# EAGLE schematic STorM32 BGC v1202 (EAGLE 6.5.0)
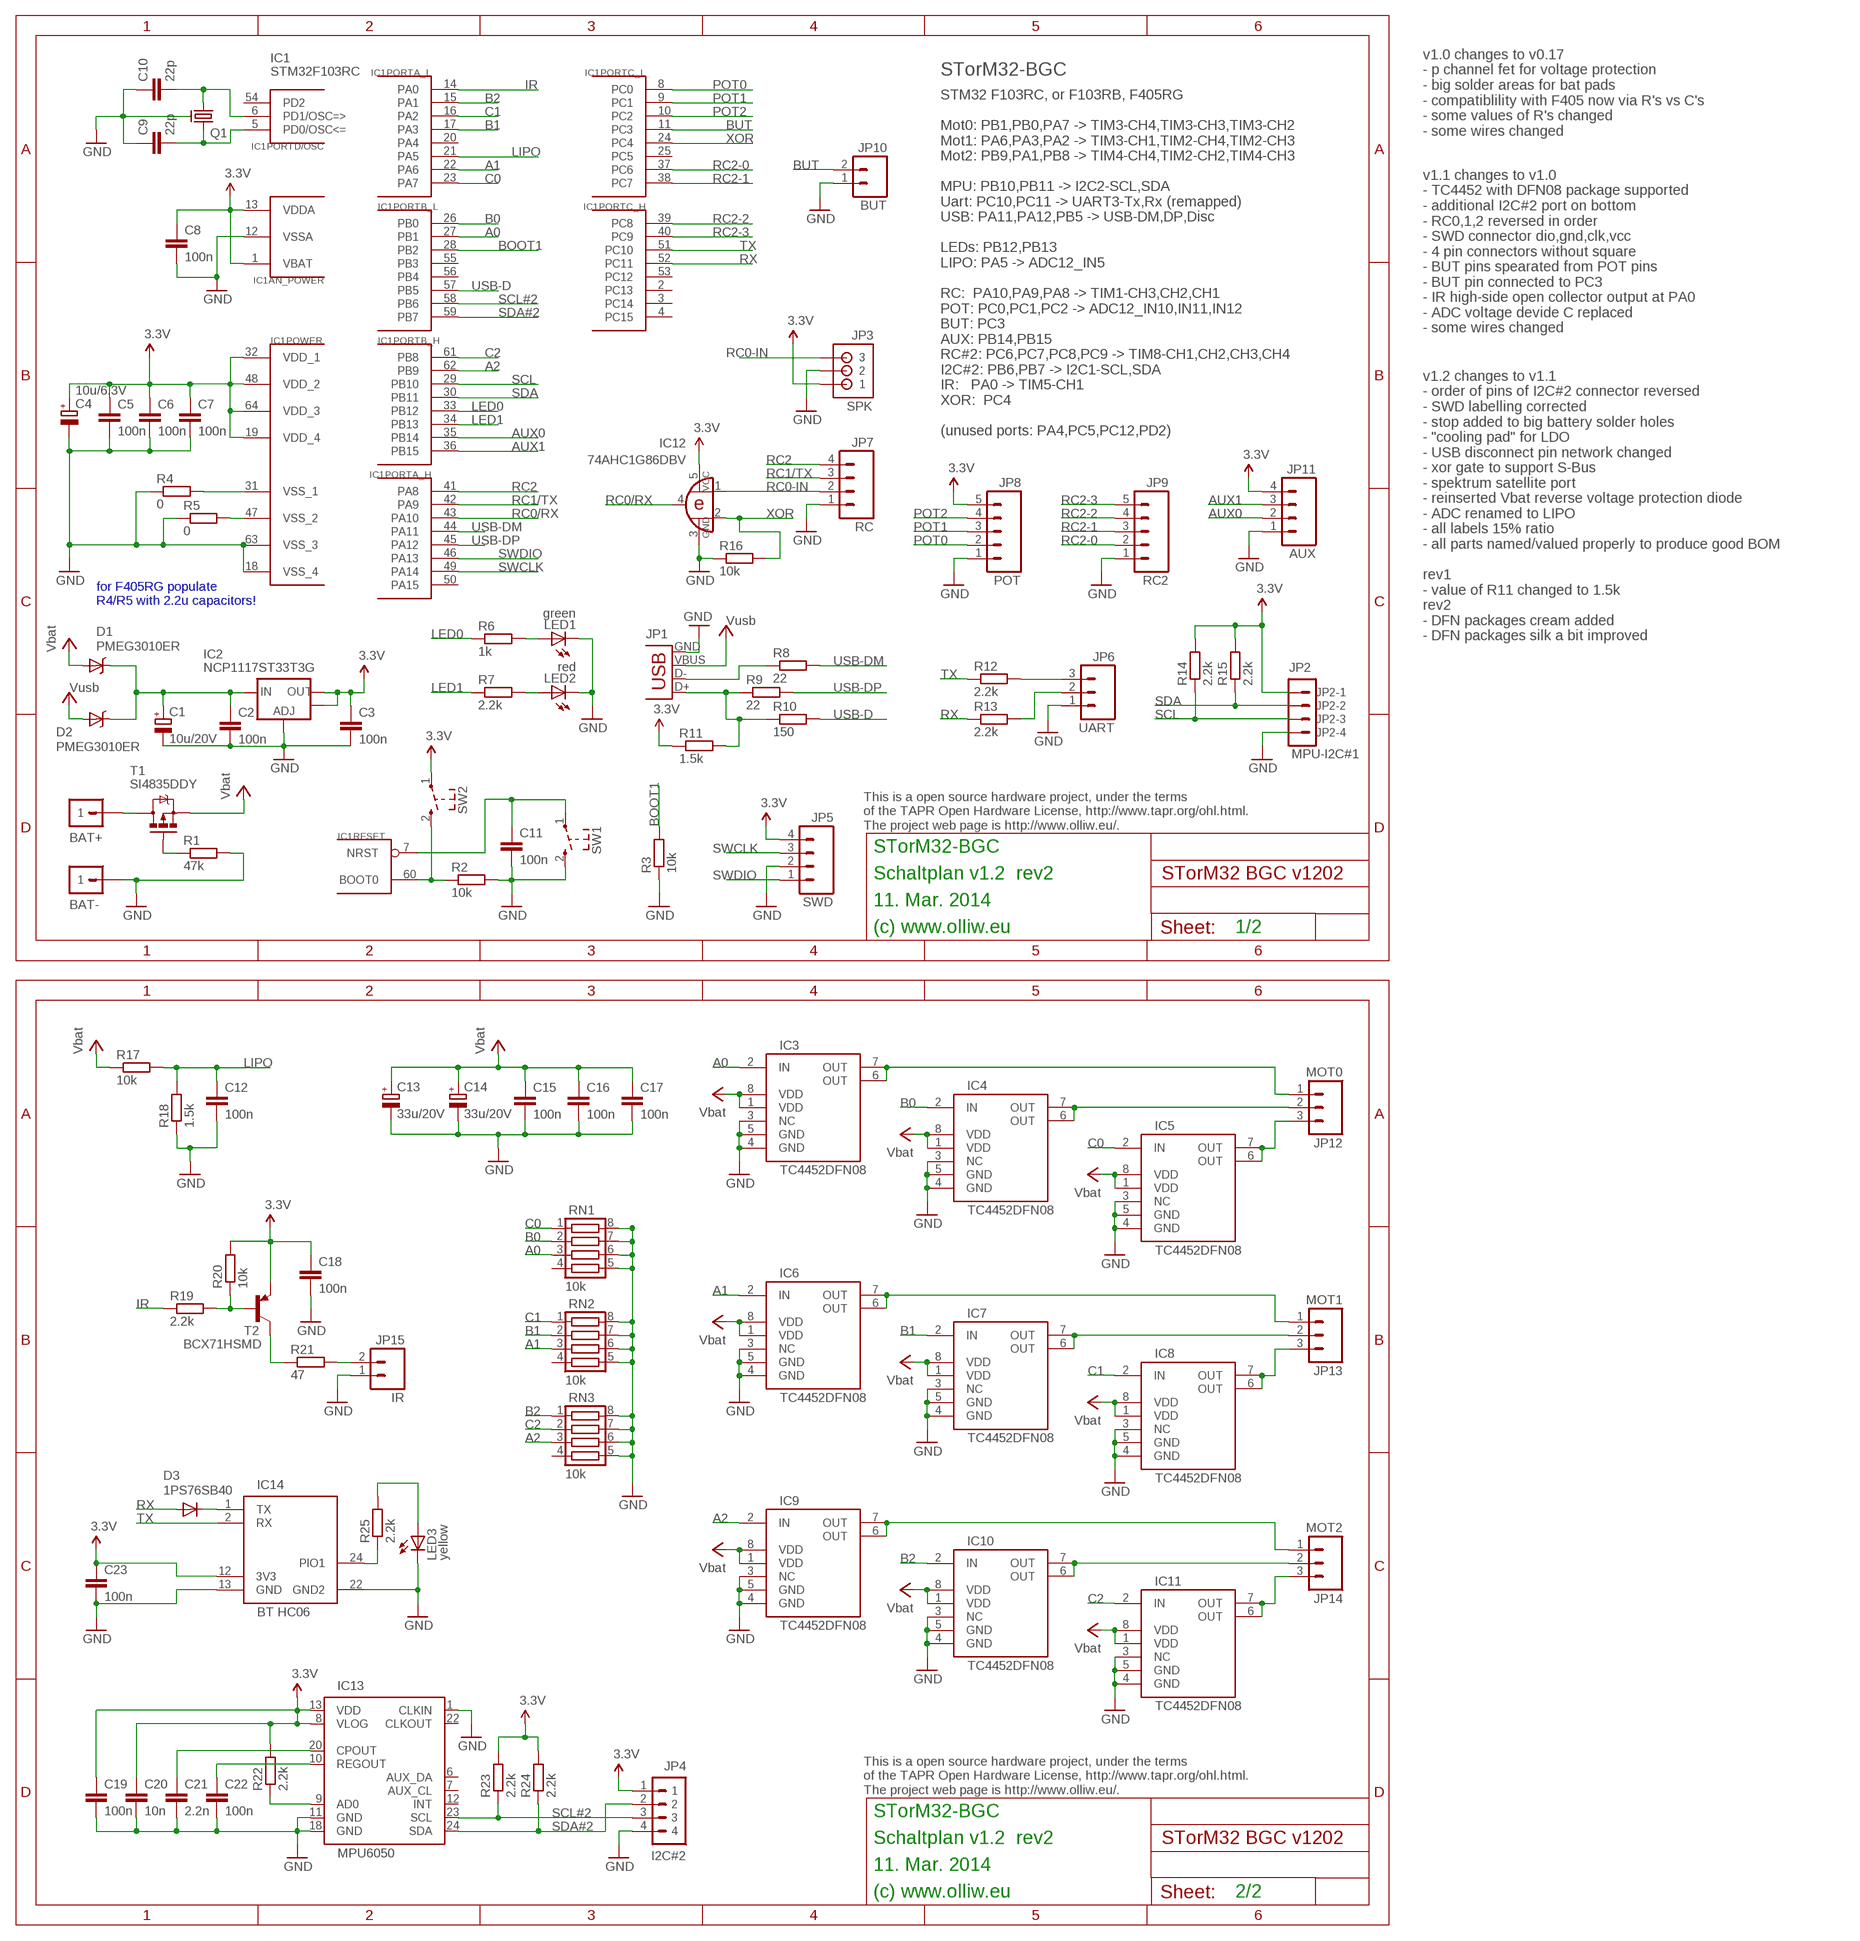
[diagram p0: schematic, sheet 1]

## Parts
BAT+  M1X1  [1X1_WITHOUT]
BAT-  M1X1  [1X1_WITHOUT]
C1  10u/20V  CPOL-EUSMCB  [SMC_B]
C2  100n  C-EUC0603  [C0603]
C3  100n  C-EUC0603  [C0603]
C4  10u/6.3V  CPOL-EUSMCA  [SMC_A]
C5  100n  C-EUC0603  [C0603]
C6  100n  C-EUC0603  [C0603]
C7  100n  C-EUC0603  [C0603]
C8  100n  C-EUC0603  [C0603]
C9  22p  C-EUC0603  [C0603]
C10  22p  C-EUC0603  [C0603]
C11  100n  C-EUC0603  [C0603]
C12  100n  C-EUC0603  [C0603]
C13  33u/20V  CPOL-EUSMCC  [SMC_C]
C14  33u/20V  CPOL-EUSMCC  [SMC_C]
C15  100n  C-EUC0603  [C0603]
C16  100n  C-EUC0603  [C0603]
C17  100n  C-EUC0603  [C0603]
C18  100n  C-EUC0603  [C0603]
C19  100n  C-EUC0603  [C0603]
C20  10n  C-EUC0603  [C0603]
C21  2.2n  C-EUC0603  [C0603]
C22  100n  C-EUC0603  [C0603]
C23  100n  C-EUC0603  [C0603]
D1  PMEG3010ER  DIODE-SCHOTTKYSOD123-W  [SOD123W-DIODE]
D2  PMEG3010ER  DIODE-SCHOTTKYSOD123-W  [SOD123W-DIODE]
D3  1PS76SB40  DIODE-SOD110-R  [SOD110-R]
IC1  STM32F103RCT6  STM32F10XRXT6  [TQFP64]
IC2  NCP1117ST33T3G  V_REG_LM1117SOT223  [SOT223]
IC3  TC4452DFN08  [DFN8]
IC4  TC4452DFN08  [DFN8]
IC5  TC4452DFN08  [DFN8]
IC6  TC4452DFN08  [DFN8]
IC7  TC4452DFN08  [DFN8]
IC8  TC4452DFN08  [DFN8]
IC9  TC4452DFN08  [DFN8]
IC10  TC4452DFN08  [DFN8]
IC11  TC4452DFN08  [DFN8]
IC12  74AHC1G86DBV  [SOT23-5]
IC13  MPU6050  IMU3000  [QFN-24]
IC14  BT HC06  HC06-BASIC  [BT_HC05_BASIC]
JP1  USBMINIBSMD  USBSMD  [USB-MINIB]
JP2  MPU-I2C#1  53-04  [53047-04SMALL]
JP3  SPK  B3B-ZR  [B3B-ZR]
JP4  I2C#2  P4X1_1P27  [MOLEX-53261-04-SMD-FLAT]
JP5  SWD  M04PTH  [1X04]
JP6  UART  M03PTH  [1X03]
JP7  RC  M04PTH  [1X04]
JP8  POT  M05PTH  [1X05]
JP9  RC2  M05PTH  [1X05]
JP10  BUT  M02PTH  [1X02]
JP11  AUX  M04PTH  [1X04]
JP12  MOT0  M03PTH  [1X03]
JP13  MOT1  M03PTH  [1X03]
JP14  MOT2  M03PTH  [1X03]
JP15  IR  M02PTH  [1X02]
LED1  green  LEDCHIPLED_0603  [CHIPLED_0603]
LED2  red  LEDCHIPLED_0603  [CHIPLED_0603]
LED3  yellow  LEDCHIPLED_0603  [CHIPLED_0603]
Q1  7B-8.000MAAJ-T  CRYSTALSMD-5X3  [CRYTSAL-SMD-5X3]
R1  47k  R-EU_R0603  [R0603]
R2  10k  R-EU_R0603  [R0603]
R3  10k  R-EU_R0603  [R0603]
R4  0  R-EU_R0603  [R0603]
R5  0  R-EU_R0603  [R0603]
R6  1k  R-EU_R0603  [R0603]
R7  2.2k  R-EU_R0603  [R0603]
R8  22  R-EU_R0603  [R0603]
R9  22  R-EU_R0603  [R0603]
R10  150  R-EU_R0603  [R0603]
R11  1.5k  R-EU_R0603  [R0603]
R12  2.2k  R-EU_R0603  [R0603]
R13  2.2k  R-EU_R0603  [R0603]
R14  2.2k  R-EU_R0603  [R0603]
R15  2.2k  R-EU_R0603  [R0603]
R16  10k  R-EU_R0603  [R0603]
R17  10k  R-EU_R0603  [R0603]
R18  1.5k  R-EU_R0603  [R0603]
R19  2.2k  R-EU_R0603  [R0603]
R20  10k  R-EU_R0603  [R0603]
R21  47  R-EU_R0603  [R0603]
R22  2.2k  R-EU_R0603  [R0603]
R23  2.2k  R-EU_R0603  [R0603]
R24  2.2k  R-EU_R0603  [R0603]
R25  2.2k  R-EU_R0603  [R0603]
RN1  10k  CTS742C083  [CTS742C083]
RN2  10k  CTS742C083  [CTS742C083]
RN3  10k  CTS742C083  [CTS742C083]
SW1  SW_TACT_2P-3X6  [SW_TACT_3X6]
SW2  SW_TACT_2P-3X6  [SW_TACT_3X6]
T1  SI4835DDY  FET-PS008  [SO08]
T2  BCX71HSMD  BCX71SMD  [SOT23]

## Nets
3.3V: C3.1 C4.+ C5.1 C6.1 C7.1 C8.1 C18.1 C19.1 C20.1 C23.1 IC1.1(AN_POWER:VBAT) IC1.13(AN_POWER:VDDA) IC1.19(POWER:VDD_4) IC1.32(POWER:VDD_1) IC1.48(POWER:VDD_2) IC1.64(POWER:VDD_3) IC2.2(OUT) IC2.4(OUT) IC12.5(VCC) IC13.8(VLOG) IC13.13(VDD) IC14.12(3V3) JP2.1 JP3.1 JP4.1 JP5.4 JP8.5 JP11.4 R11.1 R14.2 R15.2 R20.2 R22.2 R23.2 R24.2 SW2.1 T2.2(E)
A0: IC1.27(PORTB_L:PB1) IC3.2(IN) RN1.3
A1: IC1.22(PORTA_L:PA6) IC6.2(IN) RN2.3
A2: IC1.62(PORTB_H:PB9) IC9.2(IN) RN3.3
AUX0: IC1.35(PORTB_H:PB14) JP11.2
AUX1: IC1.36(PORTB_H:PB15) JP11.3
B0: IC1.26(PORTB_L:PB0) IC4.2(IN) RN1.2
B1: IC1.17(PORTA_L:PA3) IC7.2(IN) RN2.2
B2: IC1.15(PORTA_L:PA1) IC10.2(IN) RN3.1
BATP: BAT+.1 T1.5(D) T1.6(D) T1.7(D) T1.8(D)
BOOT1: IC1.28(PORTB_L:PB2) R3.2
BUT: IC1.11(PORTC_L:PC3) JP10.2
C0: IC1.23(PORTA_L:PA7) IC5.2(IN) RN1.1
C1: IC1.16(PORTA_L:PA2) IC8.2(IN) RN2.1
C2: IC1.61(PORTB_H:PB8) IC11.2(IN) RN3.2
GND: BAT-.1 C1.- C2.2 C3.2 C4.- C5.2 C6.2 C7.2 C8.2 C9.1 C10.1 C11.2 C12.2 C13.- C14.- C15.2 C16.2 C17.2 C18.2 C19.2 C20.2 C21.2 C22.2 C23.2 IC1.12(AN_POWER:VSSA) IC1.18(POWER:VSS_4) IC1.63(POWER:VSS_3) IC2.1(ADJ) IC3.3(NC) IC3.4(GND) IC3.5(GND) IC4.3(NC) IC4.4(GND) IC4.5(GND) IC5.3(NC) IC5.4(GND) IC5.5(GND) IC6.3(NC) IC6.4(GND) IC6.5(GND) IC7.3(NC) IC7.4(GND) IC7.5(GND) IC8.3(NC) IC8.4(GND) IC8.5(GND) IC9.3(NC) IC9.4(GND) IC9.5(GND) IC10.3(NC) IC10.4(GND) IC10.5(GND) IC11.3(NC) IC11.4(GND) IC11.5(GND) IC12.3(GND) IC13.1(CLKIN) IC13.11(GND) IC13.18(GND) IC14.13(GND) IC14.22(GND2) JP1.GND JP2.4 JP3.2 JP4.4 JP5.2 JP6.1 JP7.1 JP8.1 JP9.1 JP10.1 JP11.1 JP15.1 LED1.C LED2.C LED3.C Q1.2 Q1.4 R1.2 R2.2 R3.1 R4.1 R5.1 R16.1 R18.1 RN1.5 RN1.6 RN1.7 RN1.8 RN2.5 RN2.6 RN2.7 RN2.8 RN3.5 RN3.6 RN3.7 RN3.8 SW1.2
IR: IC1.14(PORTA_L:PA0) R19.1
LED0: IC1.33(PORTB_H:PB12) R6.1
LED1: IC1.34(PORTB_H:PB13) R7.1
LIPO: C12.1 IC1.21(PORTA_L:PA5) R17.2 R18.2
M0A: IC3.6(OUT) IC3.7(OUT) JP12.1
M0B: IC4.6(OUT) IC4.7(OUT) JP12.2
M0C: IC5.6(OUT) IC5.7(OUT) JP12.3
M1A: IC6.6(OUT) IC6.7(OUT) JP13.1
M1B: IC7.6(OUT) IC7.7(OUT) JP13.2
M1C: IC8.6(OUT) IC8.7(OUT) JP13.3
M2A: IC9.6(OUT) IC9.7(OUT) JP14.1
M2B: IC10.6(OUT) IC10.7(OUT) JP14.2
M2C: IC11.6(OUT) IC11.7(OUT) JP14.3
N$1: R21.1 T2.3(C)
N$2: JP15.2 R21.2
N$5: C11.1 IC1.7(RESET:NRST) SW1.1
N$6: IC1.60(RESET:BOOT0) R2.1 SW2.2
N$8: LED1.A R6.2
N$9: LED2.A R7.2
N$10: IC1.47(POWER:VSS_2) R5.2
N$11: C9.2 IC1.5(PORTD/OSC:PD0/OSC<=) Q1.3
N$12: C10.2 IC1.6(PORTD/OSC:PD1/OSC=>) Q1.1
N$15: JP1.D- R8.1
N$17: JP1.D+ R9.1 R10.1 R11.2
N$19: IC13.9(AD0) R22.1
N$20: C22.1 IC13.10(REGOUT)
N$21: IC14.24(PIO1) R25.1
N$22: LED3.A R25.2
N$23: R1.1 T1.4(G)
N$24: C21.1 IC13.20(CPOUT)
N$25: D3.C IC14.1(TX)
N$26: IC1.31(POWER:VSS_1) R4.2
N$27: R19.2 R20.1 T2.1(B)
N$29: JP6.2 R13.2
N$32: JP6.3 R12.2
POT0: IC1.8(PORTC_L:PC0) JP8.2
POT1: IC1.9(PORTC_L:PC1) JP8.3
POT2: IC1.10(PORTC_L:PC2) JP8.4
RC0-IN: IC12.1(I0) JP3.3 JP7.2
RC0/RX: IC1.43(PORTA_H:PA10) IC12.4(O)
RC1/TX: IC1.42(PORTA_H:PA9) JP7.3
RC2: IC1.41(PORTA_H:PA8) JP7.4
RC2-0: IC1.37(PORTC_L:PC6) JP9.2
RC2-1: IC1.38(PORTC_L:PC7) JP9.3
RC2-2: IC1.39(PORTC_H:PC8) JP9.4
RC2-3: IC1.40(PORTC_H:PC9) JP9.5
RX: D3.A IC1.52(PORTC_H:PC11) R13.1
SCL: IC1.29(PORTB_H:PB10) JP2.3 R14.1
SCL#2: IC1.58(PORTB_L:PB6) IC13.23(SCL) JP4.3 R23.1
SDA: IC1.30(PORTB_H:PB11) JP2.2 R15.1
SDA#2: IC1.59(PORTB_L:PB7) IC13.24(SDA) JP4.2 R24.1
SWCLK: IC1.49(PORTA_H:PA14) JP5.3
SWDIO: IC1.46(PORTA_H:PA13) JP5.1
TX: IC1.51(PORTC_H:PC10) IC14.2(RX) R12.1
USB-D: IC1.57(PORTB_L:PB5) R10.2
USB-DM: IC1.44(PORTA_H:PA11) R8.2
USB-DP: IC1.45(PORTA_H:PA12) R9.2
VCC: C13.+ C14.+ C15.1 C16.1 C17.1 D1.A IC3.1(VDD) IC3.8(VDD) IC4.1(VDD) IC4.8(VDD) IC5.1(VDD) IC5.8(VDD) IC6.1(VDD) IC6.8(VDD) IC7.1(VDD) IC7.8(VDD) IC8.1(VDD) IC8.8(VDD) IC9.1(VDD) IC9.8(VDD) IC10.1(VDD) IC10.8(VDD) IC11.1(VDD) IC11.8(VDD) R17.1 T1.1(S) T1.2(S) T1.3(S) ; supply symbol labelled Vbat
VIN: C1.+ C2.1 D1.C D2.C IC2.3(IN)
VUSB: D2.A JP1.VBUS ; supply symbol labelled Vusb
XOR: IC1.24(PORTC_L:PC4) IC12.2(I1) R16.2
Unconnected: IC1.2(PORTC_H:PC13) IC1.3(PORTC_H:PC14) IC1.4(PORTC_H:PC15) IC1.20(PORTA_L:PA4) IC1.25(PORTC_L:PC5) IC1.50(PORTA_H:PA15) IC1.53(PORTC_H:PC12) IC1.54(PORTD/OSC:PD2) IC1.55(PORTB_L:PB3) IC1.56(PORTB_L:PB4) IC13.6(AUX_DA) IC13.7(AUX_CL) IC13.12(INT) IC13.22(CLKOUT) RN1.4 RN2.4 RN3.4

## Notes on the sheet
- v1.0 changes to v0.17
  - p channel fet for voltage protection
  - big solder areas for bat pads
  - compatiblility with F405 now via R's vs C's
  - some values of R's changed
  - some wires changed
- IC1
- STM32F103RC | STorM32-BGC
- STM32 F103RC, or F103RB, F405RG
  
  Mot0: PB1,PB0,PA7 -> TIM3-CH4,TIM3-CH3,TIM3-CH2
  Mot1: PA6,PA3,PA2 -> TIM3-CH1,TIM2-CH4,TIM2-CH3
  Mot2: PB9,PA1,PB8 -> TIM4-CH4,TIM2-CH2,TIM4-CH3
  
  MPU: PB10,PB11 -> I2C2-SCL,SDA
  Uart: PC10,PC11 -> UART3-Tx,Rx (remapped)
  USB: PA11,PA12,PB5 -> USB-DM,DP,Disc
  
  LEDs: PB12,PB13
  LIPO: PA5 -> ADC12_IN5
  
  RC:  PA10,PA9,PA8 -> TIM1-CH3,CH2,CH1
  POT: PC0,PC1,PC2 -> ADC12_IN10,IN11,IN12
  BUT: PC3
  AUX: PB14,PB15
  RC#2: PC6,PC7,PC8,PC9 -> TIM8-CH1,CH2,CH3,CH4
  I2C#2: PB6,PB7 -> I2C1-SCL,SDA
  IR:   PA0 -> TIM5-CH1
  XOR:  PC4
  
  (unused ports: PA4,PC5,PC12,PD2)
- v1.1 changes to v1.0
  - TC4452 with DFN08 package supported
  - additional I2C#2 port on bottom
  - RC0,1,2 reversed in order
  - SWD connector dio,gnd,clk,vcc
  - 4 pin connectors without square
  - BUT pins spearated from POT pins
  - BUT pin connected to PC3
  - IR high-side open collector output at PA0
  - ADC voltage devide C replaced
  - some wires changed
- v1.2 changes to v1.1
  - order of pins of I2C#2 connector reversed
  - SWD labelling corrected
  - stop added to big battery solder holes
  - "cooling pad" for LDO
  - USB disconnect pin network changed
  - xor gate to support S-Bus
  - spektrum satellite port
  - reinserted Vbat reverse voltage protection diode
  - ADC renamed to LIPO
  - all labels 15% ratio
  - all parts named/valued properly to produce good BOM
  
  rev1
  - value of R11 changed to 1.5k
  rev2
  - DFN packages cream added
  - DFN packages silk a bit improved
- for F405RG populate
  R4/R5 with 2.2u capacitors!
- JP1
- JP2
- This is a open source hardware project, under the terms
  of the TAPR Open Hardware License, http://www.tapr.org/ohl.html.
  The project web page is http://www.olliw.eu/.
- STorM32-BGC
- Schaltplan v1.2  rev2
- 11. Mar. 2014
- (c) www.olliw.eu | 1/2
- This is a open source hardware project, under the terms
  of the TAPR Open Hardware License, http://www.tapr.org/ohl.html.
  The project web page is http://www.olliw.eu/.
- STorM32-BGC
- Schaltplan v1.2  rev2
- 11. Mar. 2014
- (c) www.olliw.eu | 2/2

## Library data of the parts
BAT+ BAT- = # stdlib:M1X1
C1 C4 C13 C14 = rcl:CPOL-EU: POLARIZED CAPACITOR, European symbol
C2 C3 C5-C12 C15-C23 = rcl:C-EU: CAPACITOR, European symbol
D1 D2 = # stdlib:DIODE-SCHOTTKY
D3 = diode:DIODE-: DIODE
IC1 = # stm32:STM32F10XRXT6: STM32F101/103 64pin LQFP
IC2 = # SparkFun2:V_REG_LM1117: Voltage Regulator LM1117 Standard adjustable voltage regulator but in SMD form. Spark Fun Electronics SKU : COM-00595
IC3-IC11 = # stdlib:TC4452
IC12 = 74xx-little-de:74*1G86: 2-input EXCLUSIV-OR gate
IC13 = # SparkFun2:IMU3000
IC14 = # SerialPortBluetooth:HC06-BASIC
JP1 = SparkFun:USB: USB Connectors USB-B-PTH is fully proven SKU : PRT-00139 USB-miniB is fully proven SKU : PRT-00587 USB-A-PCB is untested. USB-A-H is throughly reviewed, but untested. Spark Fun Electronics SKU : PRT-00437 USB-B-SMT is throughly reviewed, but untested. Needs silkscreen touching up. USB-A-S has not been used/tested USB-MB-H has not been used/tested
JP2 = con-molex:53?-04: CONNECTOR wire to board 1.25 mm (.049 inch) pitch header
JP3 = # jst:B3B-ZR: JST-ZH Connector 3 pol, 1.5mm pitch Package: B3B-ZR Source: http://www.jst-mfg.com/product/pdf/eng/eZH.pdf
JP4 = # stdlib:P4X1_1P27
JP5 JP7 JP11 = # SparkFun2:M04: Header 4 Standard 4-pin 0.1" header. Use with straight break away headers (SKU : PRT-00116), right angle break away headers (PRT-00553), swiss pins (PRT-00743), machine pins (PRT-00117), and female headers (PRT-00115). Molex polarized connector foot print use with SKU : PRT-08231 with associated crimp pins and housings. 1MM SMD Version SKU: PRT-10208
JP6 = # SparkFun2:M03: Header 3 Standard 3-pin 0.1" header. Use with straight break away headers (SKU : PRT-00116), right angle break away headers (PRT-00553), swiss pins (PRT-00743), machine pins (PRT-00117), and female headers (PRT-00115). Molex polarized connector foot print use with SKU : PRT-08232 with associated crimp pins and housings.
JP8 JP9 = # SparkFun2:M05: Header 5 Standard 5-pin 0.1" header. Use with straight break away headers (SKU : PRT-00116), right angle break away headers (PRT-00553), swiss pins (PRT-00743), machine pins (PRT-00117), and female headers (PRT-00115). Molex polarized connector foot print use with SKU : PRT-08230 with associated crimp pins and housings.
JP10 JP15 = # SparkFun2:M02: Header 2 Standard 2-pin 0.1" header. Use with straight break away headers (SKU : PRT-00116), right angle break away headers (PRT-00553), swiss pins (PRT-00743), machine pins (PRT-00117), and female headers (PRT-00115). Molex polarized connector foot print use with SKU : PRT-08233 with associated crimp pins and housings.
JP12-JP14 = # SparkFun:M03: Header 3 Standard 3-pin 0.1" header. Use with straight break away headers (SKU : PRT-00116), right angle break away headers (PRT-00553), swiss pins (PRT-00743), machine pins (PRT-00117), and female headers (PRT-00115). Molex polarized connector foot print use with SKU : PRT-08232 with associated crimp pins and housings.
LED1-LED3 = led:LED: LED OSRAM: - CHIPLED LG R971, LG N971, LY N971, LG Q971, LY Q971, LO R971, LY R971 LH N974, LH R974 LS Q976, LO Q976, LY Q976 LO Q996 - Hyper CHIPLED LW Q18S LB Q993, LB Q99A, LB R99A - SideLED LS A670, LO A670, LY A670, LG A670, LP A670 LB A673, LV A673, LT A673, LW A673 LH A674 LY A675 LS A676, LA A676, LO A676, LY A676, LW A676 LS A679, LY A679, LG A679 - Hyper Micro SIDELED® LS Y876, LA Y876, LO Y876, LY Y876 LT Y87S - SmartLED LW L88C, LW L88S LB L89C, LB L89S, LG L890 LS L89K, LO L89K, LY L89K LS L896, LA L896, LO L896, LY L896 - TOPLED LS T670, LO T670, LY T670, LG T670, LP T670 LSG T670, LSP T670, LSY T670, LOP T670, LYG T670 LG T671, LOG T671, LSG T671 LB T673, LV T673, LT T673, LW T673 LH T674 LS T676, LA T676, LO T676, LY T676, LB T676, LH T676, LSB T676, LW T676 LB T67C, LV T67C, LT T67C, LS T67K, LO T67K, LY T67K, LW E67C LS E67B, LA E67B, LO E67B, LY E67B, LB E67C, LV E67C, LT E67C LW T67C LS T679, LY T679, LG T679 LS T770, LO T770, LY T770, LG T770, LP T770 LB T773, LV T773, LT T773, LW T773 LH T774 LS E675, LA E675, LY E675, LS T675 LS T776, LA T776, LO T776, LY T776, LB T776 LHGB T686 LT T68C, LB T68C - Hyper Mini TOPLED® LB M676 - Mini TOPLED Santana® LG M470 LS M47K, LO M47K, LY M47K Source: http://www.osram.convergy.de LUXEON: - LUMILED® LXK2-PW12-R00, LXK2-PW12-S00, LXK2-PW14-U00, LXK2-PW14-V00 LXK2-PM12-R00, LXK2-PM12-S00, LXK2-PM14-U00 LXK2-PE12-Q00, LXK2-PE12-R00, LXK2-PE12-S00, LXK2-PE14-T00, LXK2-PE14-U00 LXK2-PB12-K00, LXK2-PB12-L00, LXK2-PB12-M00, LXK2-PB14-N00, LXK2-PB14-P00, LXK2-PB14-Q00 LXK2-PR12-L00, LXK2-PR12-M00, LXK2-PR14-Q00, LXK2-PR14-R00 LXK2-PD12-Q00, LXK2-PD12-R00, LXK2-PD12-S00 LXK2-PH12-R00, LXK2-PH12-S00 LXK2-PL12-P00, LXK2-PL12-Q00, LXK2-PL12-R00 Source: www.luxeon.com KINGBRIGHT: KA-3528ASYC Source: www.kingbright.com
Q1 = # stdlib:CRYSTAL
R1-R25 = rcl:R-EU_: RESISTOR, European symbol
RN1-RN3 = resistor-net:CTS742C083: Chip Resistor Array 4 Single Resistor Source: http://www.ctscorp.com/components/Datasheets/CTSChipArrayDs.pdf; OC_FARNELL: unknown; OC_NEWARK: unknown
SW1 SW2 = # dp_devices:SW_TACT_2P
T1 = # stdlib:FET-P
T2 = transistor-pnp:BCX71SMD: PNP Transistor